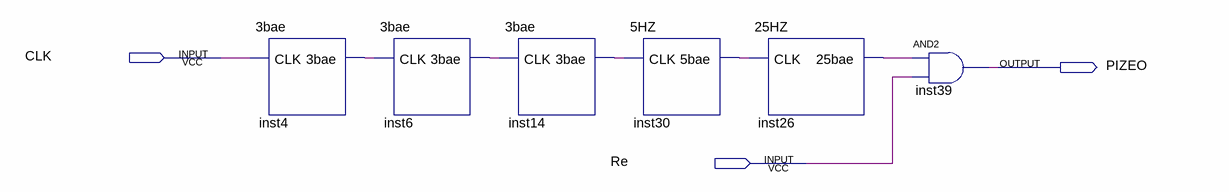
[diagram p0: schematic sheet]
// Quartus schematic Re.bdf as structural Verilog: 6 symbols, 3 pins
module Re (
  input  CLK,
  input  Re,
  output PIZEO
);

  wire inst4_3bae, inst6_3bae, inst14_3bae, inst26_25bae, inst30_5bae;

  \3bae  inst4 (.CLK(CLK), .\3bae (inst4_3bae));
  \3bae  inst6 (.CLK(inst4_3bae), .\3bae (inst6_3bae));
  \3bae  inst14 (.CLK(inst6_3bae), .\3bae (inst14_3bae));
  \5HZ  inst30 (.CLK(inst14_3bae), .\5bae (inst30_5bae));
  \25HZ  inst26 (.CLK(inst30_5bae), .\25bae (inst26_25bae));
  and inst39 (PIZEO, inst26_25bae, Re);
endmodule
